# Altium schematic sheet STM32.SchDoc
size A3; SheetNumber: 1; SheetTotal: 6
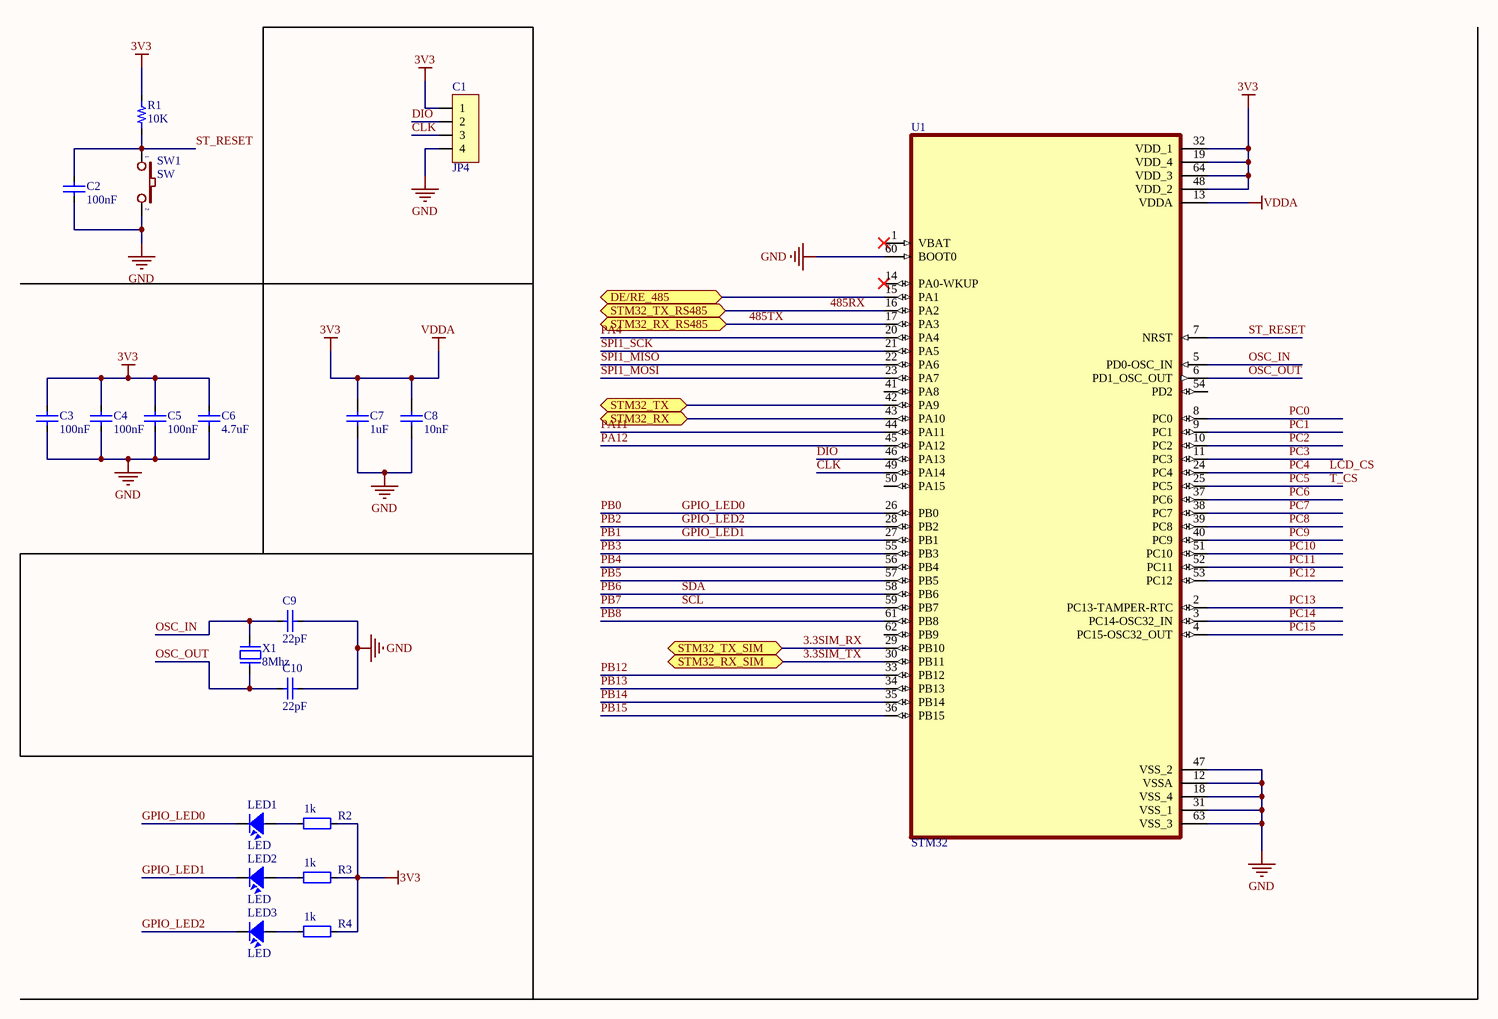
[diagram p0: STM32.SchDoc]

## Parts
C1  JP4  [JP4-C1T]
C2  100nF  [CAP_0805]
C3  100nF  [CAP_0805]
C4  100nF  [CAP_0805]
C5  100nF  [CAP_0805]
C6  4.7uF  [CAP_0805]
C7  1uF  [CAP_0805]
C8  10nF  [CAP_0805]
C9  22pF  [CAP_0805]
C10  22pF  [CAP_0805]
LED1  LED  [LED-0805-Red]
LED2  LED  [LED-0805-Green]
LED3  LED  [LED-0805-Blue]
R1  10K  [RES-SMD-0101]
R2  1k  [RES-SMD-0805]
R3  1k  [RES-SMD-0805]
R4  1k  [RES-SMD-0805]
SW1  SW  [SW2]
U1  STM32  [LQFP 64]
X1  8Mhz  [XT2]

## Ports
DE/RE_485 (bidir), STM32_RX (bidir), STM32_RX_RS485 (bidir), STM32_RX_SIM (bidir), STM32_TX (bidir), STM32_TX_RS485 (bidir), STM32_TX_SIM (bidir)

## Nets
3V3: C1.1 C3.2 C4.2 C5.2 C6.2 C7.2 C8.2 R1.1 R2.1 R3.1 R4.1 U1.13(VDDA) U1.19(VDD_4) U1.32(VDD_1) U1.48(VDD_2) U1.64(VDD_3)  [also labelled VDDA]
GND: C1.4 C2.2 C3.1 C4.1 C5.1 C6.1 C7.1 C8.1 C9.1 C10.1 SW1.2 U1.12(VSSA) U1.18(VSS_4) U1.31(VSS_1) U1.47(VSS_2) U1.60(BOOT0) U1.63(VSS_3)
3.3SIM_RX: U1.29(PB10) ; port STM32_TX_SIM
3.3SIM_TX: U1.30(PB11) ; port STM32_RX_SIM
485RX: U1.16(PA2) ; port STM32_TX_RS485
485TX: U1.17(PA3) ; port STM32_RX_RS485
CLK: C1.3 U1.49(PA14)
DE/RE_485: U1.15(PA1) ; port DE/RE_485
DIO: C1.2 U1.46(PA13)
GPIO_LED0: LED1.2 U1.26(PB0)  [also labelled PB0]
GPIO_LED1: LED2.2 U1.27(PB1)  [also labelled PB1]
GPIO_LED2: LED3.2 U1.28(PB2)  [also labelled PB2]
LCD_CS: U1.24(PC4)  [also labelled PC4]
OSC_IN: C9.2 U1.5(PD0-OSC_IN) X1.2
OSC_OUT: C10.2 U1.6(PD1_OSC_OUT) X1.1
PA4: U1.20(PA4)
PA11: U1.44(PA11)
PA12: U1.45(PA12)
PB3: U1.55(PB3)
PB4: U1.56(PB4)
PB5: U1.57(PB5)
PB6: U1.58(PB6)  [also labelled SDA]
PB7: U1.59(PB7)  [also labelled SCL]
PB8: U1.61(PB8)
PB12: U1.33(PB12)
PB13: U1.34(PB13)
PB14: U1.35(PB14)
PB15: U1.36(PB15)
PC0: U1.8(PC0)
PC1: U1.9(PC1)
PC2: U1.10(PC2)
PC3: U1.11(PC3)
PC5: U1.25(PC5)  [also labelled T_CS]
PC6: U1.37(PC6)
PC7: U1.38(PC7)
PC8: U1.39(PC8)
PC9: U1.40(PC9)
PC10: U1.51(PC10)
PC11: U1.52(PC11)
PC12: U1.53(PC12)
PC13: U1.2(PC13-TAMPER-RTC)
PC14: U1.3(PC14-OSC32_IN)
PC15: U1.4(PC15-OSC32_OUT)
SPI1_MISO: U1.22(PA6)
SPI1_MOSI: U1.23(PA7)
SPI1_SCK: U1.21(PA5)
ST_RESET: C2.1 R1.2 SW1.1 U1.7(NRST)
STM32_RX: U1.43(PA10) ; port STM32_RX
STM32_TX: U1.42(PA9) ; port STM32_TX
NetLED1_1: LED1.1 R2.2
NetLED2_1: LED2.1 R3.2
NetLED3_1: LED3.1 R4.2

Not connected (* = marked no-connect by the designer): U1 1(VBAT)* 14(PA0-WKUP)* 41(PA8) 50(PA15) 54(PD2) 62(PB9)

## Library data of the parts
C1 = JP4: WR-PHD 2.54 mm Angled Socket Header; Manufacturer: W¨¹rth Elektronik eiSos GmbH; partNo: 613004143121; ComponentLink1 Description: Manufacturer; ComponentLink2 Description: Datasheet; NoPins: 04; Created Date: 29 March 2013; ComponentLink1URL: http://www.we-online.com; ComponentLink2URL: http://katalog.we-online.de/em/datasheet/6130xx143121.pdf; Created by: Karrer Zheng
C2-C10 = CapSMD: Capacitor; Value: 33p; Published: 8-Jun-2000; LatestRevisionDate: 17-Jul-2002; LatestRevisionNote: Re-released for DXP Platform.; PackageReference: RAD-0.3; Publisher: Altium Limited
LED1-LED3 = LED: LED Single colour Green and Red; Value: LED 3 ly Single Colour
R1-R4 = Resistor - SMD: Resistor; Manufacturer: Generic Components; Class: Passive; Published: 08/06/2000; Publisher: Altium Hobart Technology Centre
SW1 = SW2: Switch button 2 pin; Value: SW chip 2 pin
U1 = STM32F103RCT6: STM32 ARM-based 32-bit MCU 72MHz 256KB
X1 = XT2: Crystal For all Crystal 2pin.; Value: 4Mhz